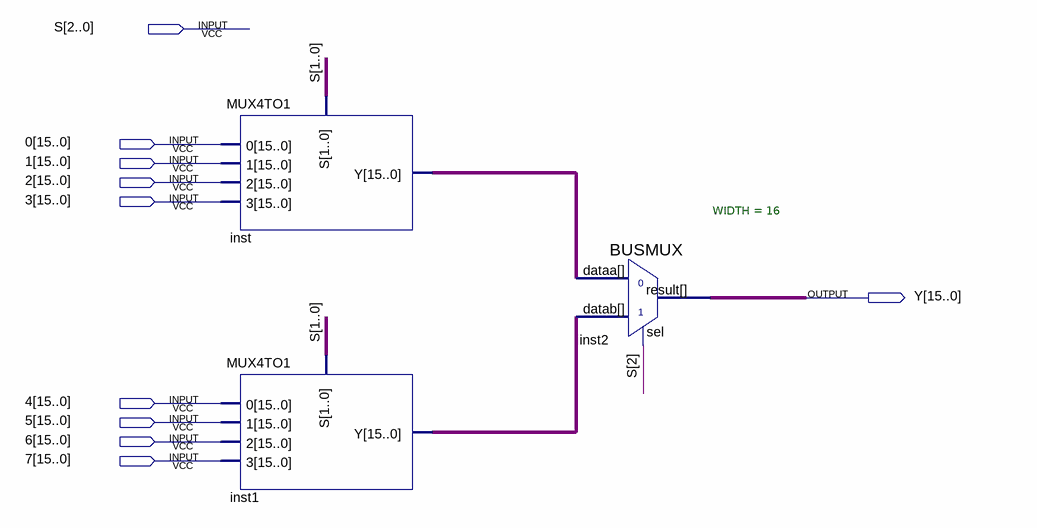
[diagram p0: schematic sheet]
// Quartus schematic MUX8TO1.bdf as structural Verilog: 3 symbols, 10 pins
module MUX8TO1 (
  input  [2:0] S,
  input  [15:0] \0 ,
  input  [15:0] \1 ,
  input  [15:0] \2 ,
  input  [15:0] \3 ,
  input  [15:0] \4 ,
  input  [15:0] \5 ,
  input  [15:0] \6 ,
  input  [15:0] \7 ,
  output [15:0] Y
);

  wire [15:0] inst1_y, inst_y;

  MUX4TO1 inst (.\0 (\0 ), .\1 (\1 ), .\2 (\2 ), .\3 (\3 ), .S(S[1:0]), .Y(inst_y));
  MUX4TO1 inst1 (.\0 (\4 ), .\1 (\5 ), .\2 (\6 ), .\3 (\7 ), .S(S[1:0]), .Y(inst1_y));
  BUSMUX #(.WIDTH(16)) inst2 (.datab(inst1_y), .sel(S[2]), .dataa(inst_y), .result(Y));
endmodule
